# Altium schematic sheet overall.SchDoc
size A4
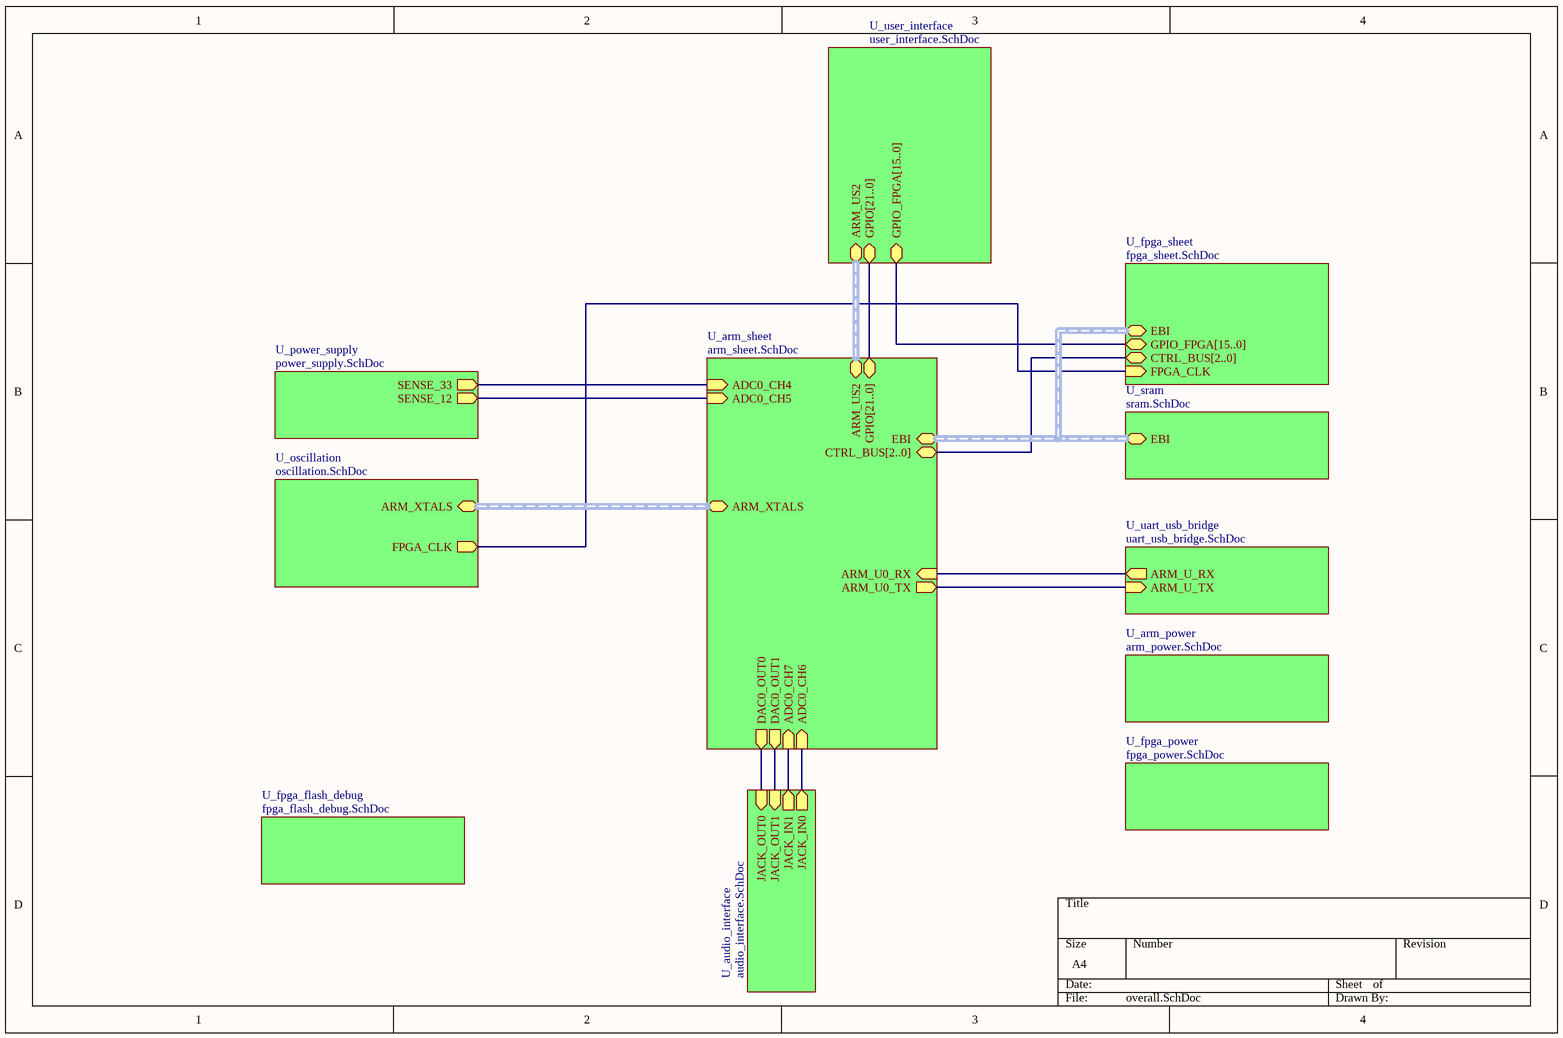
[diagram p0: overall.SchDoc]

## Sub-sheets
U_arm_power = arm_power.SchDoc: no entries
U_arm_sheet = arm_sheet.SchDoc: ARM_U0_TX (out), ARM_U0_RX (in), ADC0_CH4 (in), ADC0_CH5 (in), ADC0_CH6 (in), ADC0_CH7 (in), CTRL_BUS[2..0] (bidir), ARM_XTALS (harness ARM_XTALS), ARM_US2 (harness ARM_US2), DAC0_OUT0 (out), DAC0_OUT1 (out), GPIO[21..0] (bidir), EBI (harness EBI)
U_audio_interface = audio_interface.SchDoc: JACK_IN0 (out), JACK_IN1 (out), JACK_OUT0 (in), JACK_OUT1 (in)
U_fpga_flash_debug = fpga_flash_debug.SchDoc: no entries
U_fpga_power = fpga_power.SchDoc: no entries
U_fpga_sheet = fpga_sheet.SchDoc: GPIO_FPGA[15..0] (bidir), CTRL_BUS[2..0] (bidir), FPGA_CLK (in), EBI (harness EBI)
U_oscillation = oscillation.SchDoc: FPGA_CLK (out), ARM_XTALS (harness ARM_XTALS)
U_power_supply = power_supply.SchDoc: SENSE_33 (out), SENSE_12 (out)
U_sram = sram.SchDoc: EBI (harness EBI)
U_uart_usb_bridge = uart_usb_bridge.SchDoc: ARM_U_TX (in), ARM_U_RX (out)
U_user_interface = user_interface.SchDoc: GPIO_FPGA[15..0] (bidir), GPIO[21..0] (bidir), ARM_US2 (harness ARM_US2)

## Nets
(unnamed): sheet U_arm_sheet/ARM_U0_TX, sheet U_uart_usb_bridge/ARM_U_TX
(unnamed): sheet U_arm_sheet/ARM_U0_RX, sheet U_uart_usb_bridge/ARM_U_RX
(unnamed): sheet U_arm_sheet/ADC0_CH4, sheet U_power_supply/SENSE_33
(unnamed): sheet U_arm_sheet/ADC0_CH5, sheet U_power_supply/SENSE_12
(unnamed): sheet U_arm_sheet/ADC0_CH6, sheet U_audio_interface/JACK_IN0
(unnamed): sheet U_arm_sheet/ADC0_CH7, sheet U_audio_interface/JACK_IN1
(unnamed): sheet U_arm_sheet/DAC0_OUT0, sheet U_audio_interface/JACK_OUT0
(unnamed): sheet U_arm_sheet/DAC0_OUT1, sheet U_audio_interface/JACK_OUT1
(unnamed): sheet U_oscillation/FPGA_CLK, sheet U_fpga_sheet/FPGA_CLK

## Buses and harness runs
bus sheet U_arm_sheet/CTRL_BUS[2..0] = sheet U_fpga_sheet/CTRL_BUS[2..0]
bus sheet U_arm_sheet/GPIO[21..0] = sheet U_user_interface/GPIO[21..0]
bus sheet U_fpga_sheet/GPIO_FPGA[15..0] = sheet U_user_interface/GPIO_FPGA[15..0]
harness sheet U_arm_sheet/ARM_US2 = sheet U_user_interface/ARM_US2
harness sheet U_arm_sheet/ARM_XTALS = sheet U_oscillation/ARM_XTALS
harness sheet U_arm_sheet/EBI = sheet U_fpga_sheet/EBI = sheet U_sram/EBI